# Altium schematic sheet Synth.SchDoc
size B; SheetNumber: 1; SheetTotal: 2
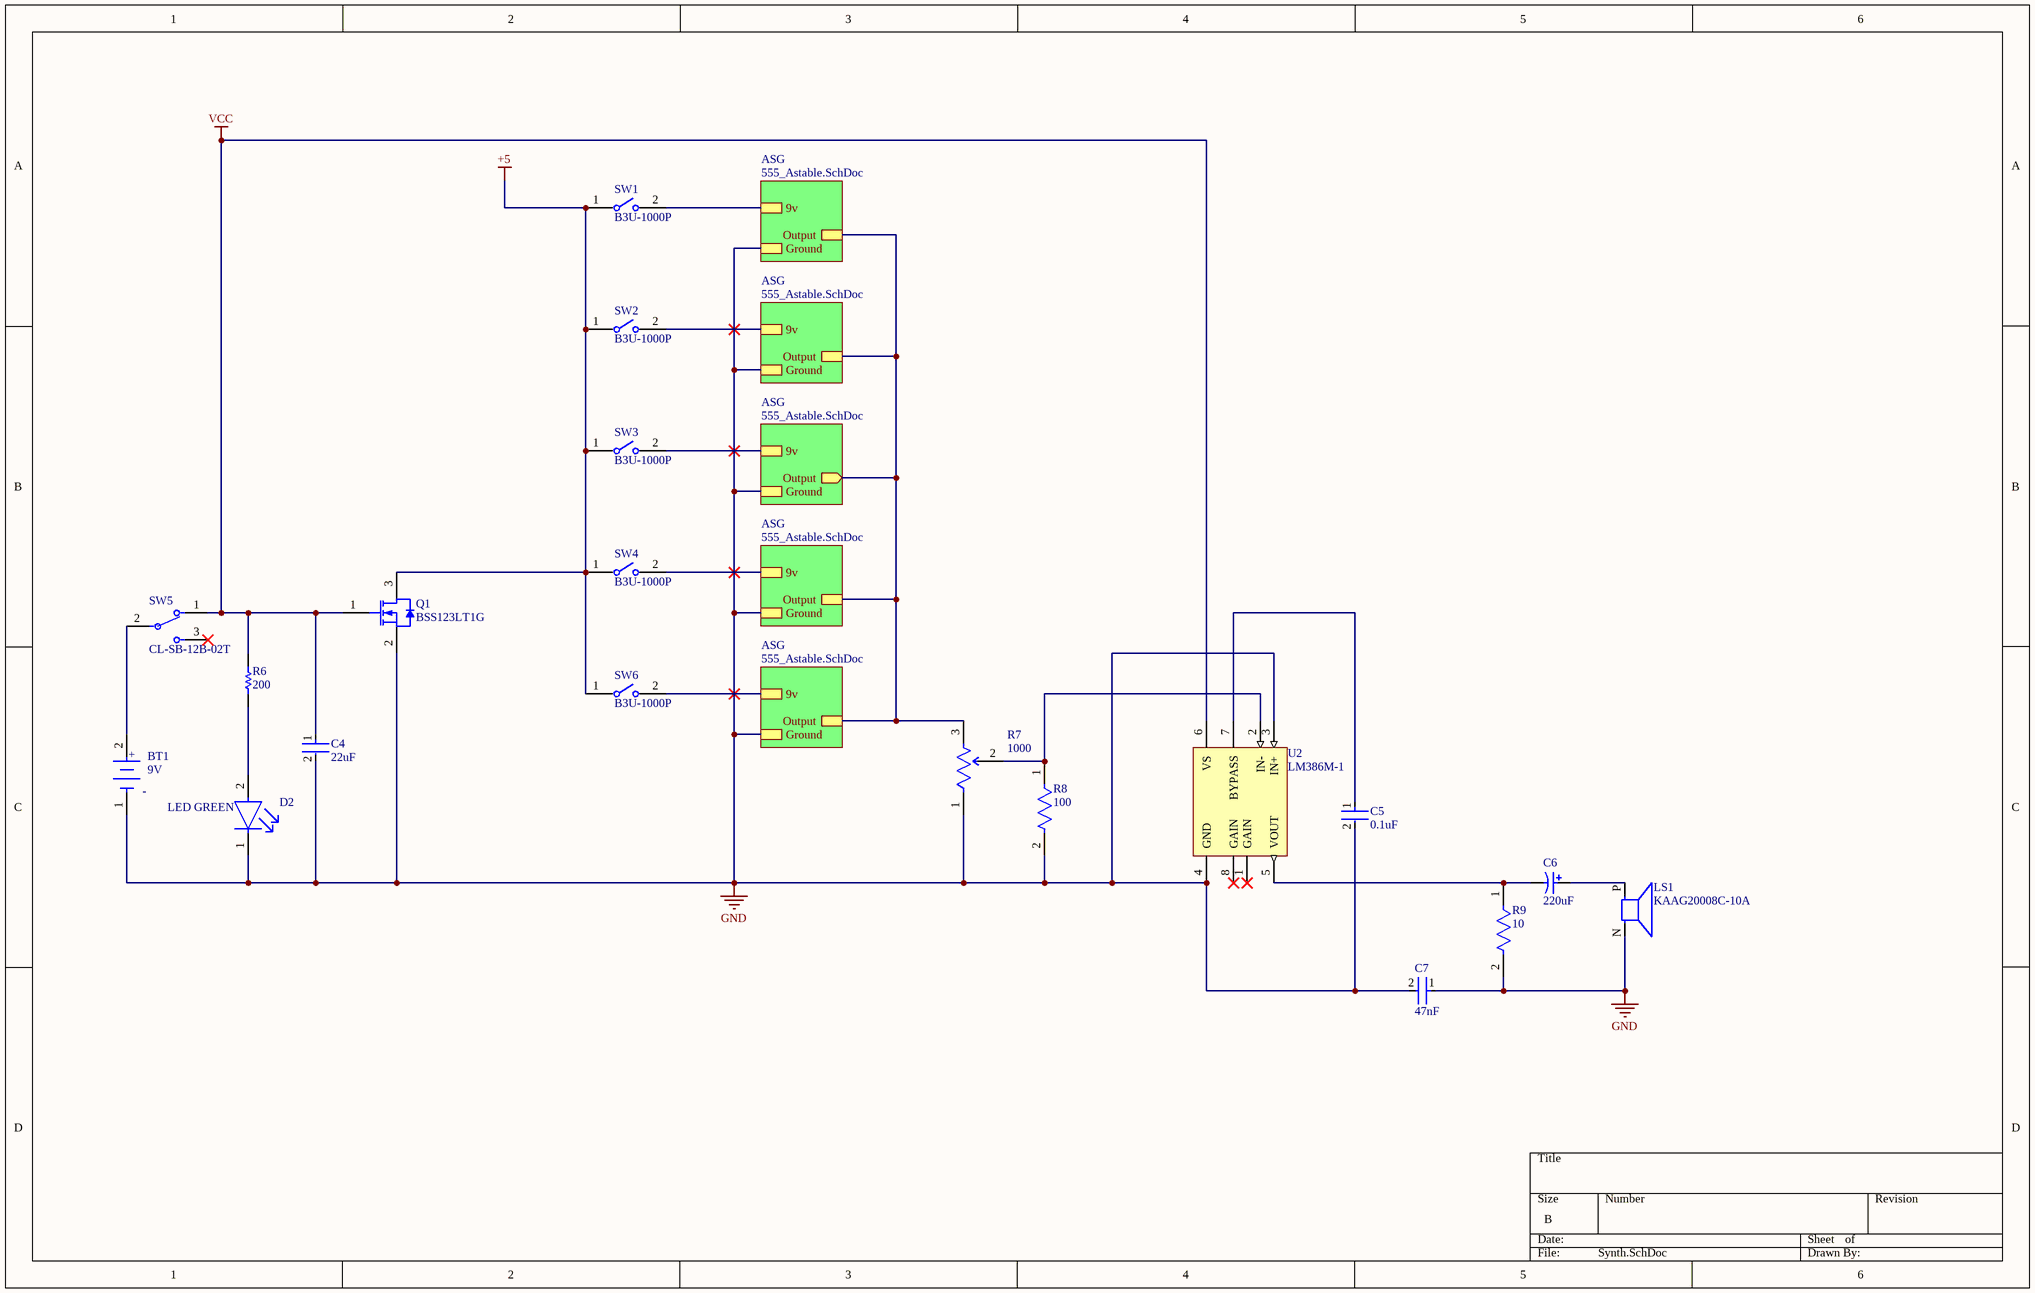
[diagram p0: Synth.SchDoc]

## Parts
BT1  9V  [FP-BH9VPC-MFG]
C4  22uF  [FP-GRM21B-0_15-MFG]
C5  0.1uF  [FP-C1206C-EB-MFG]
C6  220uF  [PNSC-EEE-FK1E221P_N]
C7  47nF  [FP-C0603C-CF-MFG]
D2  LED GREEN  [FP-LTST-C190GKT-MFG]
LS1  KAAG20008C-10A  [SPKR_KAAG20008C-10A]
Q1  BSS123LT1G  [ONSC-SOT-23-3-318-08_V]
R6  200  [RESC3216X60X45ML10T20]
R7  1000  [FP-3362P-1-102TLF-MFG]
R8  100  [FP-ERJ1GN-MFG]
R9  10  [FP-ERJ2RK-MFG]
SW1  B3U-1000P  [FP-B3U-1000P-MFG]
SW2  B3U-1000P  [FP-B3U-1000P-MFG]
SW3  B3U-1000P  [FP-B3U-1000P-MFG]
SW4  B3U-1000P  [FP-B3U-1000P-MFG]
SW5  CL-SB-12B-02T  [FP-CL-SB-12B-02T-MFG]
SW6  B3U-1000P  [FP-B3U-1000P-MFG]
U2  LM386M-1  [D0008A_M]

## Sub-sheets
ASG = 555_Astable.SchDoc: 9v, Ground, Output
ASG = 555_Astable.SchDoc: 9v, Ground, Output
ASG = 555_Astable.SchDoc: 9v, Ground, Output
ASG = 555_Astable.SchDoc: 9v, Ground, Output (out)
ASG = 555_Astable.SchDoc: 9v, Ground, Output

## Nets
+5: Q1.3(D) SW1.1 SW2.1 SW3.1 SW4.1 SW6.1
GND: BT1.1(C) C4.2 C5.2 C7.1 C7.2 D2.1(C) LS1.N(NEG) Q1.2(S) R7.1(CCW) R8.2 R9.2 U2.3(IN+) U2.4(GND) ; sheet ASG/Ground, sheet ASG/Ground, sheet ASG/Ground, sheet ASG/Ground, sheet ASG/Ground
VCC: C4.1 Q1.1(G) R6.2 SW5.1 U2.6(VS)
NetBT1_2: BT1.2(A) SW5.2(C)
NetC5_1: C5.1 U2.7(BYPASS)
NetC6_1: C6.1 LS1.P(POS)
NetC6_2: C6.2 R9.1 U2.5(VOUT)
NetD2_2: D2.2(A) R6.1
NetR7_2: R7.2(WIPER) R8.1 U2.2(IN-)
NetR7_3: R7.3(CW) ; sheet ASG/Output, sheet ASG/Output, sheet ASG/Output, sheet ASG/Output, sheet ASG/Output
NetSW1_2: SW1.2 ; sheet ASG/9v
NetSW2_2: SW2.2 ; sheet ASG/9v
NetSW3_2: SW3.2 ; sheet ASG/9v
NetSW4_2: SW4.2 ; sheet ASG/9v
NetSW6_2: SW6.2 ; sheet ASG/9v

Not connected (* = marked no-connect by the designer): SW5 3*; U2 1(GAIN)* 8(GAIN)*

## Notes on the sheet
- (in symbol CMP-136216-000001-1) +; -

## Library data of the parts
BT1 = CMP-136216-000001-1: BATTERY HOLDER 9V PC PIN BH9VPC; Manufacturer: Memory Protection Devices; Description: Battery Holder (Open) 9V 1 Cell PC Pin; Conn Orientation: Vertical; Is Female: yes; Number Of Contacts: 2; Device Class L2: unset; Contact Material: Nickel; Device Class L1: Connectors; Lead Free: Yes; Digikey Description: BATTERY HOLDER 9V PC PIN; Category: Batt; ComponentLink2URL: http://www.memoryprotectiondevices.com/datasheets/BH9VPC-datasheet.pdf; Device Class L3: unset; Package: 0; Automotive: No; ComponentLink2Description: Datasheet; Height: 21.12mm; Voltage Rating: 9V; Octopart: https://octopart.com/bh9vpc-memory+protection+devices-22788154; RoHS: TRUE; Manufacturer Part Number: BH9VPC
C4 = CMP-2007-03385-2: Chip Multilayer Ceramic Capacitors for General Purpose, 0805, 22uF, X5R, 15%, 20%, 6.3V GRM21BR60J226ME39L; Material: Ceramic; Max Operating Temperature: 85°C; Voltage: 6.3V; Min Operating Temperature: -55°C; Case/Package: 0805; Thickness: 0.053inch; Dielectric: X5R; Packaging: Tape and Reel; Depth: 1.25mm; Termination: SMD/SMT; Voltage Rating (DC): 6.3V; Radiation Hardening: No; Tolerance: 20%; Mount: Surface Mount; Lead Free: Lead Free; Package Quantity: 1; REACH SVHC: No SVHC; Voltage Rating: 6.3V; Capacitance: 22uF; Length: 2mm; Case Code (Imperial): 0805; Case Code (Metric): 2012; Width: 0.049inch; Height: 1.25mm
C5 = CMP-1037-04222-2: CAP CER 0.1UF 200V 10% X7R 1206 C1206C104K2RACTU; Manufacturer: KEMET; Automotive Grade: Grade 0; Tolerance: 0.1; Value: 0.10 μF; Material: Ceramic; Temperature Coefficient: 15%; Description: C1206 0.10 μF X7R 10.00% 200 V; Automotive: Yes; Temperature Characteristic: X7R; Digikey Description: CAP CER 0.1UF 200V 10% X7R 1206; ComponentLink2URL: https://content.kemet.com/datasheets/KEM_C1007_X8R_ULTRA_150C_SMD.pdf; Voltage Rating: 200 V; Manufacturer Part Number: C1206C104K2RACTU; Temperature Range High: +150°C; Device Class L1: Passive Components; Octopart: https://octopart.com/c1206c104k2ractu-kemet-9138344; Temperature: -55°C to +150°C; Height: 0.88mm; Device Class L3: Ceramic Capacitors; Lead Free: Yes; Package: C1206C-EB; Category: Cap; Temperature Range Low: -55°C; Mouser Description: Multilayer Ceramic Capacitors MLCC - SMD/SMT 200volts 0.1uF X7R 10%; Ipc Land Pattern Name: CAPC320160X78; Capacitance: 0.10 μF; RoHS: TRUE; ComponentLink2Description: Datasheet; Device Class L2: Capacitors
C6 = CMP-1665-00017-3: Aluminum Electrolytic Capacitor, 220 uF, +/- 20%, 25 V, -55 to 105 degC, 2-Pin CAPAE, RoHS, Tape and Reel EEE-FK1E221P; Manufacturer: Panasonic; Voltage Rating: 25 V; ComponentLink2URL: http://industrial.panasonic.com/cdbs/www-data/pdf/RDE0000/ABA0000C1181.pdf; Height: 10.2 mm; Max Operating Temperature: 105 degC; PackageReference: EEE-FK1E221P; ComponentLink1Description: Manufacturer URL; ComponentLink1URL: http://www.panasonic.com/; Mount: Surface Mount; REACH SVHC: No SVHC; Min Operating Temperature: -55 degC; ComponentLink2Description: Datasheet; DatasheetVersion: 03/2016; Length: 10.2 mm; RoHSCompliant: true; Packaging: Tape and Reel; Package Quantity: 500; Lead Pitch: 3.1 mm; Pins: 2; PackageDescription: 2-Pin Electrolytic Aluminum Capacitor, Body 8.3 x 8.3 mm; Mounting Technology: Surface Mount
C7 = CMP-2006-03232-2: CAP CER 0.047UF 50V 10% X7R 0603 C0603C473K5RACTU; Manufacturer: KEMET; Value: 47,000 pF; Tolerance: 0.1; Description: C0603 47,000 pF X7R 30ppm/°C 10.00% 50 V; Temperature Coefficient: 30ppm/°C; Material: Ceramic; Automotive Grade: Grade 1; Lead Free: Yes; ComponentLink2URL: https://api.kemet.com/component-edge/download/datasheet/C0603C100J5GACAUTO.pdf; Temperature Characteristic: X7R; Category: Cap; Temperature Range High: +125°C; Automotive: Yes; Device Class L3: Ceramic Capacitors; Height: 0.87mm; Temperature: -55°C to +125°C; Mouser Description: Multilayer Ceramic Capacitors MLCC - SMD/SMT 50volts 47000pF X7R 10%; Package: C0603C-CF; Device Class L1: Passive Components; Digikey Description: CAP CER 0.047UF 50V 10% X7R 0603; Device Class L2: Capacitors; Voltage Rating: 50 V; Capacitance: 47,000 pF; ComponentLink2Description: Datasheet; RoHS: TRUE; Manufacturer Part Number: C0603C473K5RACTU; Octopart: https://octopart.com/c0603c473k5ractu-kemet-9138594; Temperature Range Low: -55°C
D2 = CMP-22017-000005-2: LED GREEN CLEAR CHIP SMDLTST-C190GKT; Dominant Wavelength: 569nm; Reverse Voltage: 5V; Lens Color: Colorless; Viewing Angle: 130°; Voltage: 2V; Forward Current: 30mA; Power Dissipation: 100mW; Luminous Intensity: 6mcd; Number of LEDs: 1; Forward Voltage: 2.1V; Wavelength: 565nm; Test Current: 10mA; Min Operating Temperature: -55°C; Lens Style: Clear; Mount: Surface Mount; Width: 0.8mm; Packaging: Tape and Reel; Lens Transparency: Clear; Case Code (Metric): 1608; Depth: 0.8mm; Case Code (Imperial): 0603; Case/Package: 0603; Number of Pins: 2; Max Operating Temperature: 85°C; Lead Free: Lead Free; Number of Elements: 1; Length: 1.6mm; Height: 0.8mm; Package Quantity: 1; Power Rating: 100mW; Radiation Hardening: No; Illumination Color: Green; Color: Green
LS1 = KAAG20008C-10A: High SPL Micro Speaker, 20mm, 1W, 88dB, 1400Hz; MF: Kingstate; Check_prices: https://www.snapeda.com/parts/KAAG20008C-10A/Kingstate/view-part/?ref=eda; Price: None; Package: None; Availability: In Stock; SnapEDA_Link: https://www.snapeda.com/parts/KAAG20008C-10A/Kingstate/view-part/?ref=snap; Value: *; MP: KAAG20008C-10A
Q1 = CMP-1058-00788-1: Power MOSFET, 170 mA, 100 V, N-Channel, 3-Pin SOT-23, Pb-Free, Tape and Reel; Manufacturer: On Semiconductor; Ciss Typ (pF): 20; Channel Polarity: N Channel; Configuration: Single; PD Max (W): 0.225; V(BR)DSS Min (V): 100; ID Max (A): 0.17; VGS(th) Max (V): 2.6; Crss Typ (pF): 4; Coss Typ (pF): 9; ComponentLink2Description: Datasheet; ComponentLink3URL: http://www.onsemi.cn/pub_link/Collateral/318-08.PDF; Mounting Technology: Surface Mount; ComponentLink1Description: Manufacturer URL; DatasheetVersion: Rev. 8; PartNumber: BSS123LT1G; ComponentLink3Description: Package Specification; PackageDescription: 3-Pin Small Outline Transistor, Body 2.92 x 1.3 mm, Pitch 0.95 mm; PackageVersion: Rev. AP, 11/2009; ComponentLink1URL: http://www.onsemi.com/; PackageReference: SOT-23-3-318-08; RoHS: Pb-Free; Package Type: SOT-23-3; VGS Max (V): 20; Packing: Tape and Reel; ComponentLink2URL: http://www.onsemi.com/pub_link/Collateral/BSS123LT1-D.PDF
R6 = CMP-2003-01956-1: CRCW1206220RFKEA; Manufacturer: Vishay Dale; Part Number: CRCW1206220RFKEA
R7 = CMP-07234-000030-1: TRIMMER 1K OHM 0.5W PC PIN TOP 3362P-1-102TLF; Power Rating: 500mW; Tolerance: 10%; Resistance: 1kR; Number of Turns: 1; Temperature Coefficient: 100ppm/°C; Weight: 0.02oz; RoHS Compliant: Yes; Contact Plating: Tin; Mount: Through Hole; Max Operating Temperature: 125°C; Series: Trimpot® 3362 - Sealed; Packaging: Rail/Tube; Depth: 7.04mm; Resistor Type: Cermet; Length: 6.71mm; Width: 4.7mm; Max Power Dissipation: 500mW; Termination: Pin; Package Quantity: 200; Military Standard: Not; Technology: CERMET; Min Operating Temperature: -55°C; Height: 0.185inch
R8 = CMP-2004-03443-2: RES SMD 100 OHM 1% 1/20W 0201ERJ-1GNF1000C; Manufacturer: Panasonic Electronic Components; Automotive Grade: Grade 1; Temperature Coefficient: 200ppm/°C; Description: Res Thick Film 0201 100 Ohm 1% 1/20W ±200ppm/°C Molded SMD Pressed Carrier T/R; Value: 100Ω; Power Rating: 0.05W; Voltage Rating: 25V; Height: 0.26mm; Series: ERJ; Category: Res; Device Class L3: Chip SMD Resistors; Octopart: https://octopart.com/erj-1gnf1000c-panasonic-55419695; ComponentLink2URL: https://industrial.panasonic.com/cdbs/www-data/pdf/RDA0000/AOA0000C304.pdf; Manufacturer Part Number: ERJ-1GNF1000C; Footprint Url: https://industrial.panasonic.com/cdbs/www-data/pdf/RDA0000/DMA0000COL17.pdf; Tolerance: 1%; Digikey Description: RES SMD 100 OHM 1% 1/20W 0201; Temperature Range Low: -55°C; Mouser Description: Thick Film Resistors 0201 100ohm 1% HalogenFree AEC-Q200; Temperature: -55°C to +125°C; Device Class L2: Resistors; Package: ERJ1GN; Lead Free: Yes; Resistance: 100Ω; Composition: Thick Film; Automotive: Yes; Temperature Range High: +125°C; Device Class L1: Passive Components; ComponentLink2Description: Datasheet; RoHS: TRUE
R9 = CMP-2002-00622-4: RES SMD 10 OHM 1% 1/10W 0402 ERJ-2RKF10R0X; Manufacturer: Panasonic; Power Rating: 0.1W; Value: 10Ω; Automotive Grade: Grade 0; Description: Res Thick Film 0402 10 Ohm 1% 0.1W(1/10W) ±100ppm/C Molded SMD Automotive Punched T/R; Temperature Coefficient: 100ppm/°C; Voltage Rating: 50V; Octopart: https://octopart.com/erj-2rkf10r0x-panasonic-55404982; Digikey Description: RES SMD 10 OHM 1% 1/10W 0402; Mouser Description: Thick Film Resistors - SMD 0402 10.0ohms 1% Tol AEC-Q200; Series: ERJ; Temperature Range High: +155°C; ComponentLink2Description: Datasheet; Tolerance: 1%; Manufacturer Part Number: ERJ-2RKF10R0X; Temperature Range Low: -55°C; RoHS: TRUE; Footprint Url: https://industrial.panasonic.com/cdbs/www-data/pdf/RDA0000/DMA0000COL17.pdf; Lead Free: Yes; Device Class L2: Resistors; ComponentLink2URL: https://industrial.panasonic.com/cdbs/www-data/pdf/RDA0000/AOA0000C304.pdf; Height: 0.4mm; Device Class L3: Chip SMD Resistors; Device Class L1: Passive Components; Automotive: Yes; Resistance: 10Ω; Category: Res; Temperature: -55°C to +155°C; Composition: Thick Film; Package: ERJ2RK
SW1-SW4 SW6 = CMP-2100-03586-2: SWITCH TACTILE SPST-NO 0.05A 12V; Contact Resistance: 100mR; Operating Force: 1.5N; Max Current Rating: 50mA; Switch Travel: 0.15mm; Actuator Type: Standard; Mechanical Life: 200000Cycles; Ratings: Dust Proof; Illumination Type: Non-Illuminated; Throw Configuration: SPST; Actuator Length: 0.4mm; Switch Function: Off-Mom; Height: 1.2mm; Width: 3mm; Weight: 0.000776oz; Contact Material: Silver; Max Voltage Rating (DC): 12V; Insulation Resistance: 100MR; Lead Free: Lead Free; Current Rating: 50mA; Termination: SMD/SMT; Length: 4mm; Voltage Rating (DC): 12V; Contact Current Rating: 50mA; Orientation: Straight; Depth: 2.5mm; Max Operating Temperature: 70°C; Packaging: Tape and Reel; Min Operating Temperature: -25°C; Package Quantity: 1; Mount: Surface Mount; Electrical Life: 200000Cycles
SW5 = CMP-71745-000009-1: SWITCH SLIDE SPDT 200MA 12V; Contact Style: Non-Shorting; Actuator Length: 2mm; Actuator Type: Standard; Switch Function: On-On; Electrical Life: 10000Cycles; Operating Force: 153gf; Actuator Material: Nylon; Throw Configuration: SPDT; Mount: Surface Mount; Termination: Gull Wing; Packaging: Cut Tape; Contact Material: Copper; Max Operating Temperature: 85°C; Switch Travel: 2mm; Voltage Rating (DC): 12V; RoHS Compliant: Yes; Series: CL-SB; Contact Plating: Gold; Current Rating: 200mA; Min Operating Temperature: -40°C
U2 = CMP-0057-00421-4: Low Voltage Audio Power Amplifier, 8-pin Narrow SOIC; Manufacturer: Texas Instruments; PackageTopMarking: NSZXTT*LM386*M-1; CompType: Audio IC; PowerWise: N; ComponentLink1Description: Datasheet URL; Code_IPC: SOIC127P600-8; PackageDescription: SOIC Narrow, 4.9 x 3.9 x 1.45mm, 8 Lead, 1.27mm Pitch; Code_JEDEC: MS-012-AA; PinCount: 8; ComponentLink1URL: http://www.ti.com/general/docs/lit/getliterature.tsp?genericPartNumber=LM386&fileType=pdf; RoHS: N; PackageReference: D0008A